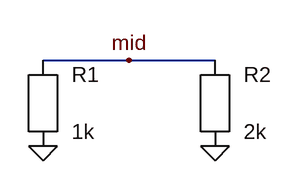
[diagram p0: schematic label_on_wire_interior.asc]
label_on_wire_interior.asc, the LTspice schematic file:
Version 4
SHEET 1 880 680
WIRE 96 96 288 96
SYMBOL res 96 144 R0
SYMATTR InstName R1
SYMATTR Value 1k
SYMBOL res 288 144 R0
SYMATTR InstName R2
SYMATTR Value 2k
FLAG 96 192 0
FLAG 288 192 0
FLAG 192 96 mid

The netlist it stands for:
* label_on_wire_interior.asc
R1 mid 0 1k
R2 mid 0 2k
.backanno
.end